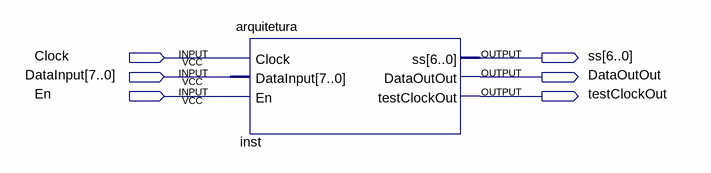
[diagram p0: schematic sheet]
// Quartus schematic final.bdf as structural Verilog: 1 symbols, 6 pins
module \final  (
  input  Clock,
  input  [7:0] DataInput,
  input  En,
  output [6:0] ss,
  output DataOutOut,
  output testClockOut
);

  arquitetura inst (
    .Clock(Clock), .DataInput(DataInput), .En(En), .ss(ss), .DataOutOut(DataOutOut),
    .testClockOut(testClockOut));
endmodule
